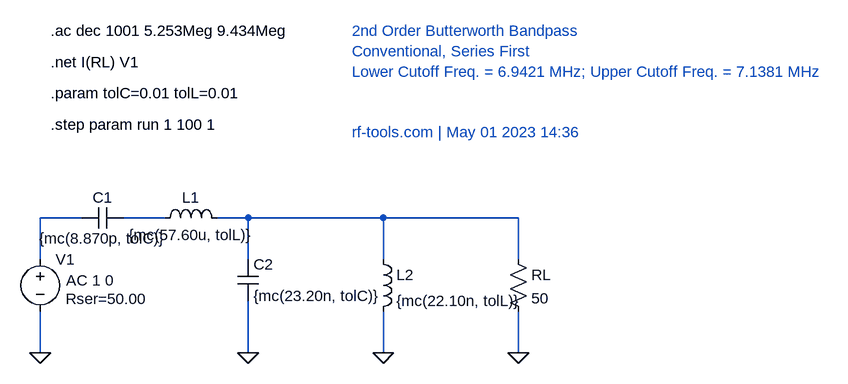
[diagram p0: schematic Bandpass filter.asc]
Bandpass filter.asc, the LTspice schematic file:
Version 4
SHEET 1 1220 400
WIRE 64 0 0 0
WIRE 192 0 128 0
WIRE 320 0 272 0
WIRE 528 0 320 0
WIRE 736 0 528 0
WIRE 0 64 0 0
WIRE 320 64 320 0
WIRE 528 64 528 0
WIRE 736 64 736 0
WIRE 0 208 0 144
WIRE 320 208 320 128
WIRE 528 208 528 144
WIRE 736 208 736 144
FLAG 0 208 0
FLAG 320 208 0
FLAG 528 208 0
FLAG 736 208 0
SYMBOL voltage 0 48 R0
WINDOW 123 40 48 Left 2
WINDOW 39 39 77 Left 2
SYMATTR Value2 AC 1 0
SYMATTR SpiceLine Rser=50.00
SYMATTR InstName V1
SYMATTR Value ""
SYMBOL cap 64 16 R270
WINDOW 0 32 32 VTop 2
WINDOW 3 0 32 VBottom 2
SYMATTR InstName C1
SYMATTR Value {mc(8.870p, tolC)}
SYMBOL ind 176 16 R270
WINDOW 0 32 56 VTop 2
WINDOW 3 5 56 VBottom 2
SYMATTR InstName L1
SYMATTR Value {mc(57.60u, tolL)}
SYMBOL cap 304 64 R0
SYMATTR InstName C2
SYMATTR Value {mc(23.20n, tolC)}
SYMBOL ind 512 48 R0
SYMATTR InstName L2
SYMATTR Value {mc(22.10n, tolL)}
SYMBOL res 720 48 R0
SYMATTR InstName RL
SYMATTR Value 50
TEXT 16 -288 Left 2 !.ac dec 1001 5.253Meg 9.434Meg
TEXT 16 -240 Left 2 !.net I(RL) V1
TEXT 16 -192 Left 2 !.param tolC=0.01 tolL=0.01
TEXT 16 -144 Left 2 !.step param run 1 100 1
TEXT 480 -288 Left 2 ;2nd Order Butterworth Bandpass\nConventional, Series First\nLower Cutoff Freq. = 6.9421 MHz; Upper Cutoff Freq. = 7.1381 MHz\n\n\nrf-tools.com | May 01 2023 14:36

The netlist it stands for:
* Bandpass filter.asc
V1 N001 0 AC 1 0 Rser=50.00
C1 N001 N002 {mc(8.870p, tolC)}
L1 N002 N003 {mc(57.60u, tolL)}
C2 N003 0 {mc(23.20n, tolC)}
L2 N003 0 {mc(22.10n, tolL)}
RL N003 0 50
.ac dec 1001 5.253Meg 9.434Meg
.net I(RL) V1
.param tolC=0.01 tolL=0.01
.step param run 1 100 1
* 2nd Order Butterworth Bandpass
* Conventional, Series First
* Lower Cutoff Freq. = 6.9421 MHz; Upper Cutoff Freq. = 7.1381 MHz
* rf-tools.com | May 01 2023 14:36
.backanno
.end